# EAGLE design adapter2 (EAGLE 7.3.0)
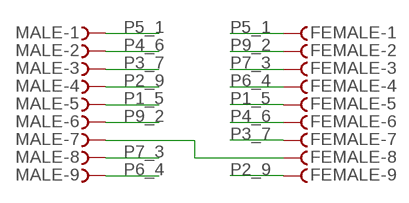
[diagram p0: schematic, sheet 1]

## Parts
FEMALE  F09DS  [F09D]
MALE  F09DS  [F09D]

## Nets
N$1: FEMALE.8 MALE.7
P1_5: FEMALE.5 MALE.5
P2_9: FEMALE.9 MALE.4
P3_7: FEMALE.7 MALE.3
P4_6: FEMALE.6 MALE.2
P5_1: FEMALE.1 MALE.1
P6_4: FEMALE.4 MALE.9
P7_3: FEMALE.3 MALE.8
P9_2: FEMALE.2 MALE.6

## Library data of the parts
FEMALE MALE = con-subd:F09?S: SUB-D; OC_FARNELL: unknown; OC_NEWARK: unknown

## Board
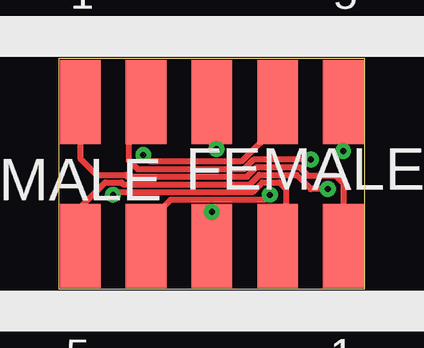
[diagram p1: board, top side]
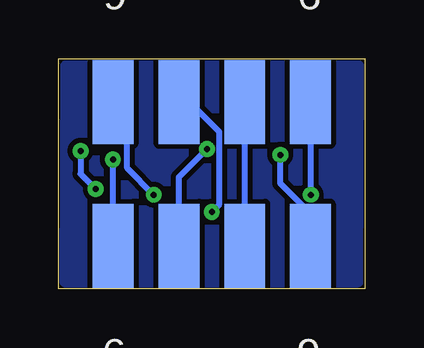
[diagram p2: board, bottom side, seen from below]

No outline drawn. Coordinates in mm, seen from the top.
Copper layers (1*16): Top 0.035mm / dielectric 1.5mm / Bottom 0.035mm
Design rules "default": minimum track width 10mil, minimum drill 24mil, track to track 8mil, track to pad 8mil, pad to pad 8mil, via to via 8mil, smd to smd 8mil, copper to edge 40mil, drill to drill 8mil, minimum pad ring 10mil, minimum via ring 8mil, stop-mask expansion 4mil, vias tented up to drill 0mil, thermal gap 10mil
Milling: 4 lines

### Footprints (pad centres in the part's own frame; a part is rotated, then mirrored left to right if it is on the bottom)
F09D = smd 1.7 x 3.5: 1 -5.486,-6.045; 2 -2.743,-6.045; 3 0,-6.045; 4 2.743,-6.045; 5 5.486,-6.045 | smd 1.7 x 3.5 bottom: 6 -4.115,-6.045; 7 -1.372,-6.045; 8 1.372,-6.045; 9 4.115,-6.045

### Placement (x,y rotation side)
FEMALE  9.21,-3.25 180 top
MALE  9.21,14.84 0 top

### Tracks (layer width: path | path; a pad name or v marks a point on that pad's centre or on a via)
GND
  pour Bottom: 3.06,10.32 15.32,10.32 15.36,1.27 3.1,1.27
N$1
  Bottom 0.254: MALE.7 FEMALE.8
P1_5  (via drill 0.25)
  Top 0.254: FEMALE.5 3.72,4.4 4.76,5.44 5.44,5.44 5.52,5.36 10.79,5.36 11.19,5.75 12.74,5.75 13.34,5.16 v14.05,5.16 | v14.68,6.75 14.68,8.19 MALE.5
  Bottom 0.254: v14.68,6.75 14.68,5.79 v14.05,5.16
P2_9  (via drill 0.25)
  Top 0.254: MALE.4 11.95,7.78 10.44,6.31 6.63,6.31 v6.35,6.59
  Bottom 0.254: FEMALE.9 5.09,4.14 6.35,5.4 v6.35,6.59
P3_7  (via drill 0.25)
  Top 0.254: v9.41,6.83 9.21,7.03 MALE.3
  Bottom 0.254: FEMALE.7 10.58,5.65 v9.41,6.83
P4_6  (via drill 0.25)
  Top 0.254: MALE.2 5.75,8.09 5.75,6.35 6.11,5.99 10.56,5.99 10.95,6.39 v13.34,6.39
  Bottom 0.254: FEMALE.6 13.32,6.34 v13.34,6.39
P5_1
  Top 0.254: MALE.1 3.72,6.44 4.41,5.75 5.6,5.75 5.67,5.67 10.68,5.67 11.07,6.07 12.86,6.07 13.22,5.71 14.37,5.71 14.68,5.4 FEMALE.1
P6_4  (via drill 0.25)
  Top 0.254: FEMALE.4 6.46,3.69 7.5,4.72 11.43,4.72 v11.63,4.92
  Bottom 0.254: MALE.9 12.74,8.21 12.74,6.03 v11.63,4.92
P7_3  (via drill 0.25)
  Top 0.254: v9.21,4.21 FEMALE.3
  Bottom 0.254: MALE.8 10.15,8.8 8.89,7.54 8.89,4.52 v9.21,4.21
P9_2  (via drill 0.25)
  Top 0.254: 12.58,3.69 11.95,3.06 FEMALE.2 12.38,3.22 12.3,3.3 12.3,5.16 12.03,5.44 11.31,5.44 10.91,5.04 5.2,5.04 v5.08,4.92
  Bottom 0.254: v5.08,4.92 5.08,8.79 MALE.6